# EasyEDA schematic 1-Schematic_CessnaCitationX_AP.json
TITLE: AP BOARD; REV: 1.0; Date: 2018-11-17; Sheet: 1/1; Drawn By: F-ORKI
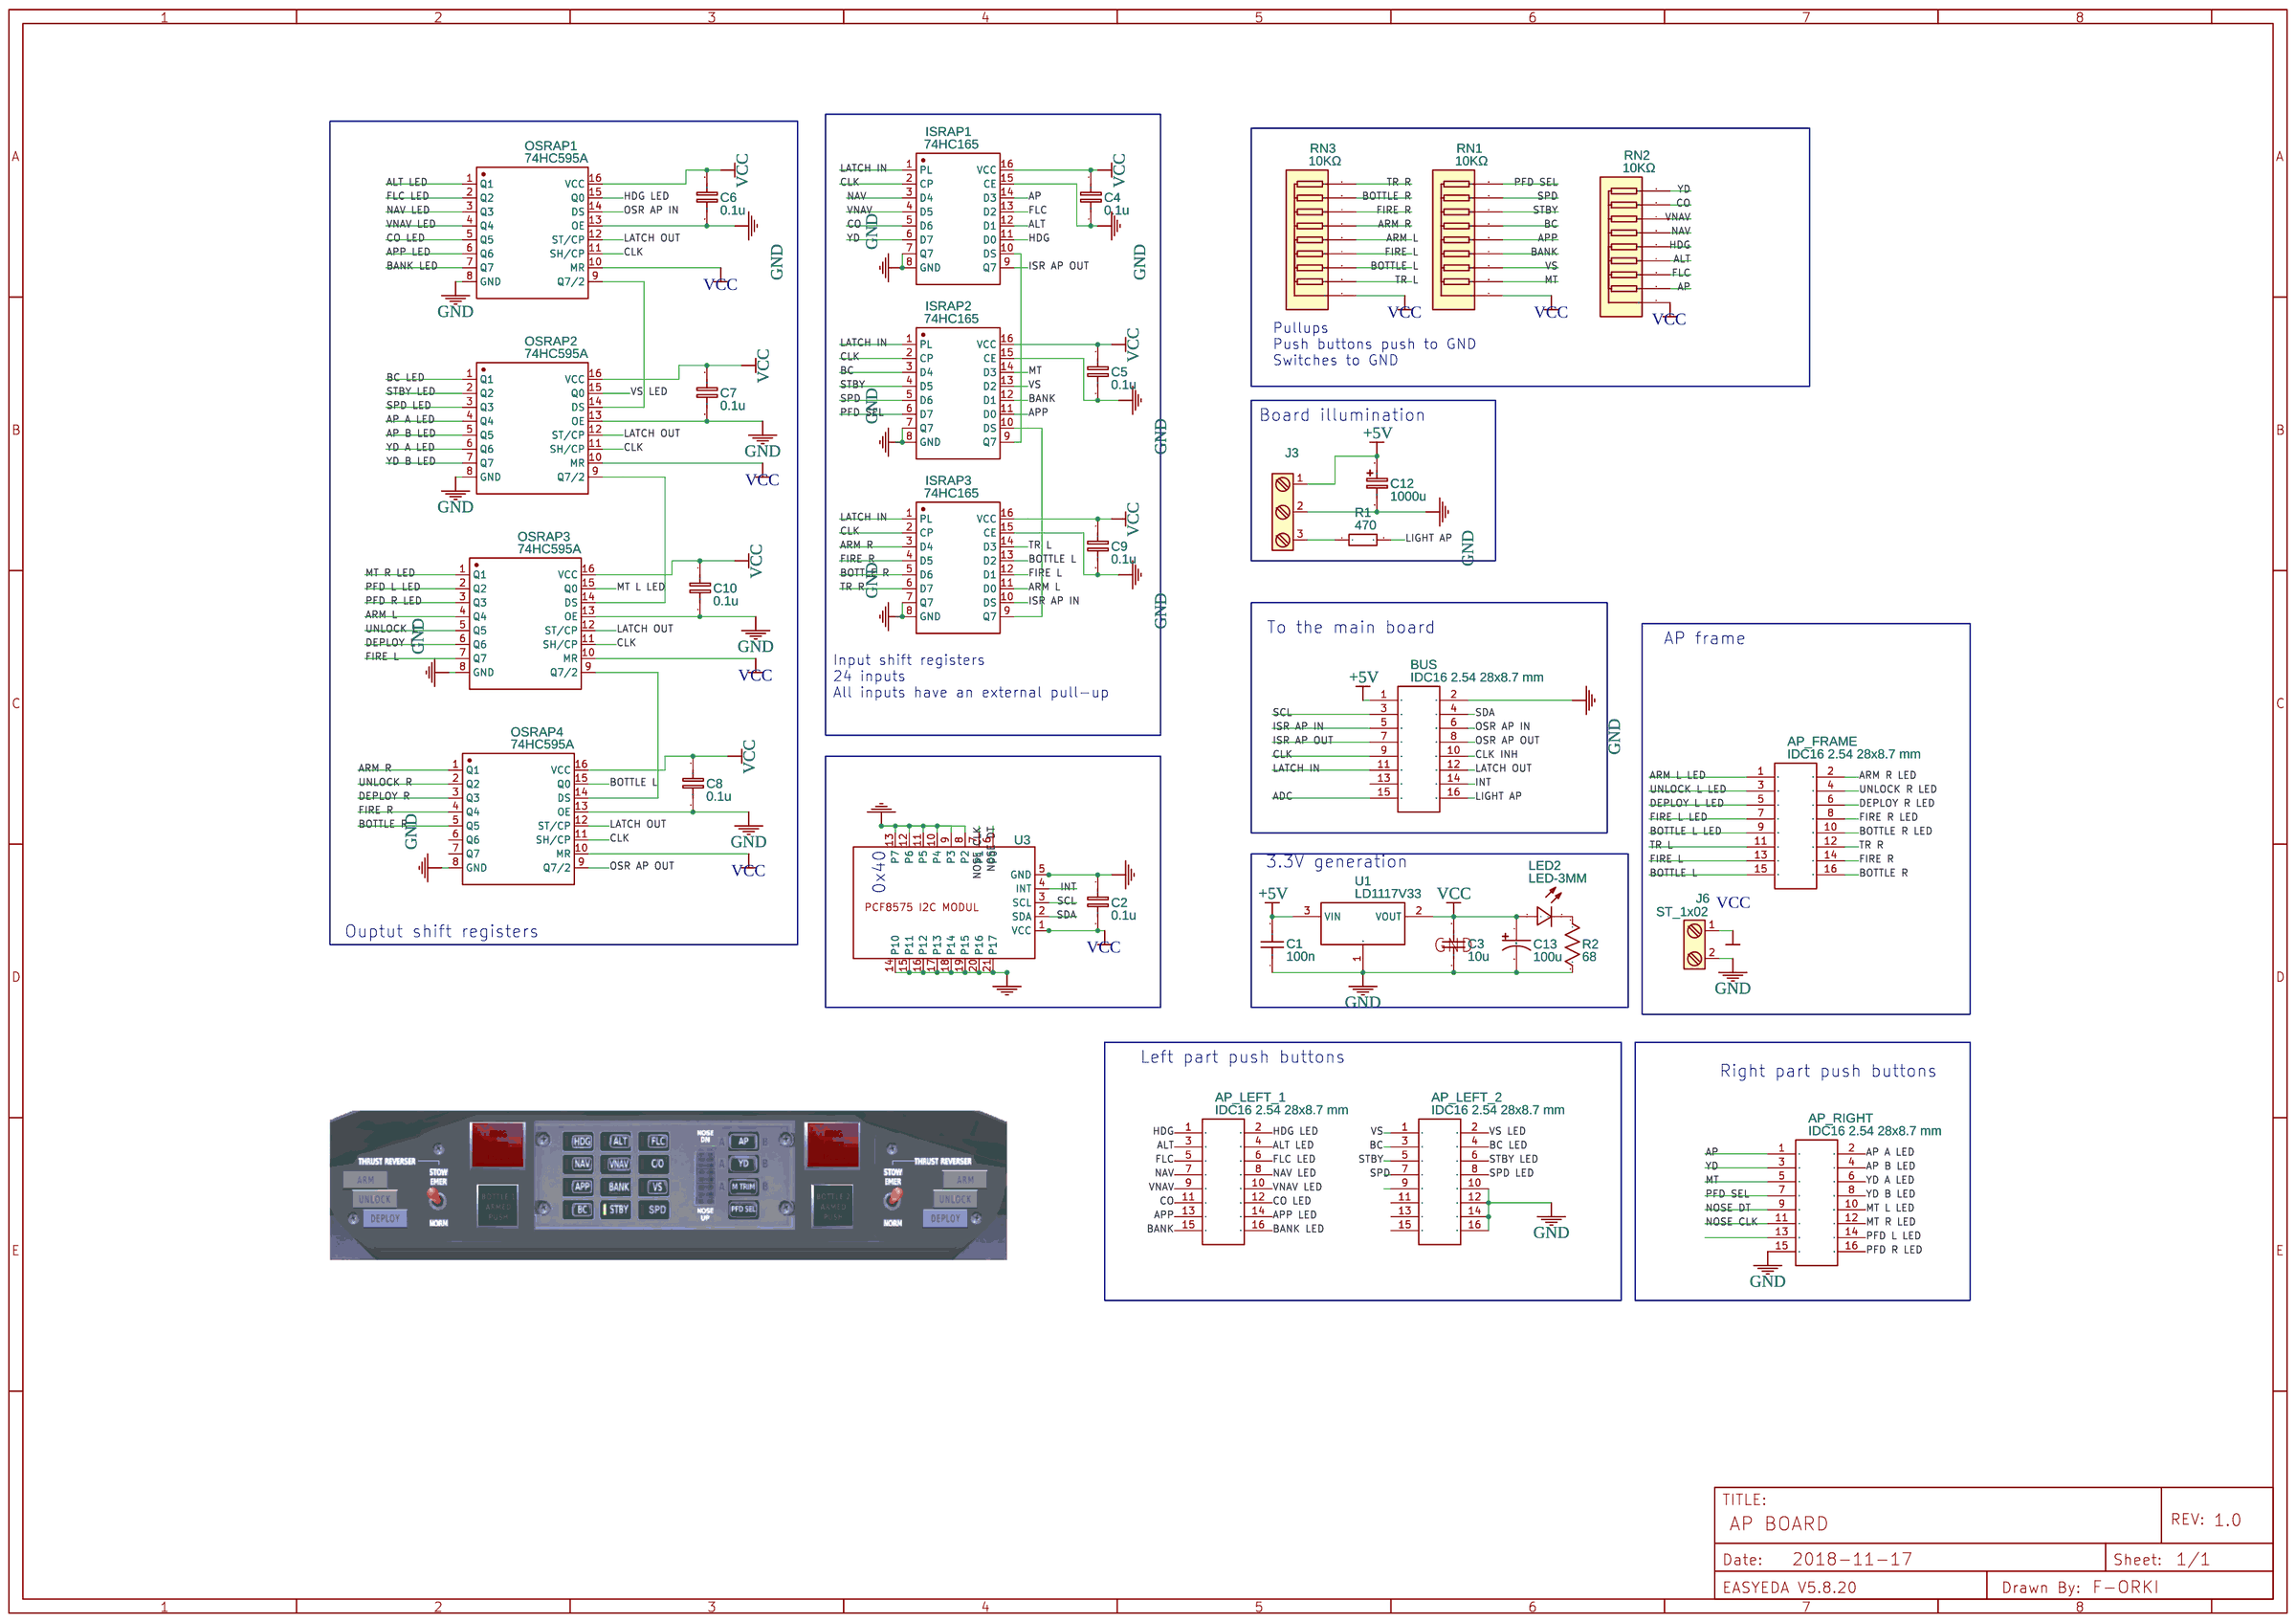
[diagram p0: schematic sheet]

## Parts
AP_FRAME  IDC16 2.54 28x8.7 mm  [IDC16 2.54 28X8.7 MM]
AP_LEFT_1  IDC16 2.54 28x8.7 mm  [IDC16 2.54 28X8.7 MM]
AP_LEFT_2  IDC16 2.54 28x8.7 mm  [IDC16 2.54 28X8.7 MM]
AP_RIGHT  IDC16 2.54 28x8.7 mm  [IDC16 2.54 28X8.7 MM]
BUS  IDC16 2.54 28x8.7 mm  [IDC16 2.54 28X8.7 MM]
C1  100n  [RAD-0.1]
C2  0.1u  [RAD-0.1]
C3  10u  [RAD-0.1]
C4  0.1u  [RAD-0.1]
C5  0.1u  [RAD-0.1]
C6  0.1u  [RAD-0.1]
C7  0.1u  [RAD-0.1]
C8  0.1u  [RAD-0.1]
C9  0.1u  [RAD-0.1]
C10  0.1u  [RAD-0.1]
C12  1000u  [CAP-D3.0XF1.5]
C13  100u  [CAP-D3.0XF1.5]
ISRAP1  74HC165  [DIP16]
ISRAP2  74HC165  [DIP16]
ISRAP3  74HC165  [DIP16]
J3  Screw_Terminal_1x03  [TERMINALBLOCK_PHEONIX_MPT-2.54MM_3POL]
J6  ST_1x02  [TERMINALBLOCK_PHEONIX_MPT-2.54MM_2POL]
LED2  LED-3MM  [LED-3MM/2.54]
OSRAP1  74HC595A  [DIP-16]
OSRAP2  74HC595A  [DIP-16]
OSRAP3  74HC595A  [DIP-16]
OSRAP4  74HC595A  [DIP-16]
R1  470  [AXIAL-0.3]
R2  68  [AXIAL-0.3]
RN1  10KΩ  [SIP-9]
RN2  10KΩ  [SIP-9]
RN3  10KΩ  [SIP-9]
U1  LD1117V33  [TO-220(TO-220-3)]
U3  PCF8575C  [PCF8575C CJMCU-8575]

## Library data of the parts
AP_FRAME AP_LEFT_1 AP_LEFT_2 AP_RIGHT BUS = -: Manufacturer Part: ?; Contributor: julien.pitault.1984
C1 C3 = Cap_RAD-0.1_US: Manufacturer Part: ?
C2 C4-C10 = Cap_RAD-0.1_EU: Manufacturer Part: ?
C12 = Cap_Electrolytic(TH)_D3.0XF1.5_EU: Contributor: EasyEDA; Manufacturer Part: ?
C13 = Cap_Electrolytic(TH)_D3.0XF1.5_US: Manufacturer Part: ?
ISRAP1-ISRAP3 = -: Supplier: LCSC; Manufacturer: Nexperia; Manufacturer Part: 74HC165D,653; LCSC Assembly: Yes; image: //image.lceda.cn/szlcsc/C5613.jpg; Contributor: LCSC; Supplier Part: C5613
J3 J6 = -: Contributor: KiCAD; license: https://www.gnu.org/licenses/lgpl-2.1.html; Manufacturer Part: ?
LED2 = -: Supplier: LCSC; Manufacturer: EVERLIGHT; Manufacturer Part: 204-10SURD/S530-A3; Supplier Part: C99772
OSRAP1-OSRAP4 = -: Supplier: LCSC; Manufacturer: FM; Contributor: LCSC; Supplier Part: C110383
R1 = Res_AXIAL-0.3(1/8W)_EU: Manufacturer Part: ?
R2 = Res_AXIAL-0.3(1/8W)_US: Manufacturer Part: ?
RN1-RN3 = A09-103JP: Supplier: LCSC; Manufacturer: FH; Contributor: LCSC; Supplier Part: C8692
U1 = -: Supplier: LCSC; Supplier Part: C283467; Manufacturer: STMicroelectronics; Contributor: LCSC
U3 = -: Manufacturer Part: ?

## Nets
+5V: BUS.1(P1) C1.2 C12.1 J3.1 U1.3(VIN)
GND: AP_LEFT_2.10(P10) AP_LEFT_2.12 AP_LEFT_2.14 AP_LEFT_2.16 AP_RIGHT.15 BUS.2(P2) C1.1 C2.1 C3.1 C4.2 C5.2 C6.2 C7.2 C8.2 C9.2 C10.2 C12.2 C13.2 ISRAP1.7(Q7) ISRAP1.8(GND) ISRAP1.15(CE) ISRAP2.7(Q7) ISRAP2.8(GND) ISRAP2.15(CE) ISRAP3.7(Q7) ISRAP3.8(GND) ISRAP3.15(CE) J3.2 J6.2 OSRAP1.8(GND) OSRAP1.13(OE) OSRAP2.8(GND) OSRAP2.13(OE) OSRAP3.8(GND) OSRAP3.13(OE) OSRAP4.8(GND) OSRAP4.13(OE) R2.2 U1.1(GND) U3.5(GND) U3.8(P2) U3.9(P3) U3.10(P4) U3.11(P5) U3.12(P6) U3.13(P7) U3.14(P10) U3.15(P11) U3.16(P12) U3.17(P13) U3.18(P14) U3.19(P15) U3.20(P16) U3.21(P17)
VCC: C2.2 C3.2 C4.1 C5.1 C6.1 C7.1 C8.1 C9.1 C10.1 C13.1 ISRAP1.16(VCC) ISRAP2.16(VCC) ISRAP3.16(VCC) J6.1 LED2.1(+) OSRAP1.10(MR) OSRAP1.16(VCC) OSRAP2.10(MR) OSRAP2.16(VCC) OSRAP3.10(MR) OSRAP3.16(VCC) OSRAP4.10(MR) OSRAP4.16(VCC) RN1.1 RN2.1 RN3.1 U1.2(VOUT) U3.1(VCC)
ADC: BUS.15
ALT: AP_LEFT_1.3(P3) ISRAP1.12(D1) RN2.4
ALT LED: AP_LEFT_1.4(P4) OSRAP1.1(Q1)
AP: AP_RIGHT.1(P1) ISRAP1.14(D3) RN2.2
AP A LED: AP_RIGHT.2(P2) OSRAP2.4(Q4)
AP B LED: AP_RIGHT.4(P4) OSRAP2.5(Q5)
APP: AP_LEFT_1.13 ISRAP2.11(D0) RN1.5
APP LED: AP_LEFT_1.14 OSRAP1.6(Q6)
ARM L: ISRAP3.11(D0) OSRAP3.4(Q4)
ARM L LED: AP_FRAME.1(P1)
ARM R: ISRAP3.3(D4) OSRAP4.1(Q1) RN3.6
ARM R LED: AP_FRAME.2(P2)
BANK: AP_LEFT_1.15 ISRAP2.12(D1) RN1.4
BANK LED: AP_LEFT_1.16 OSRAP1.7(Q7)
BC: AP_LEFT_2.3(P3) ISRAP2.3(D4) RN1.6
BC LED: AP_LEFT_2.4(P4) OSRAP2.1(Q1)
BOTTLE L: AP_FRAME.15 ISRAP3.13(D2) OSRAP4.15(Q0)
BOTTLE L LED: AP_FRAME.9(P9)
BOTTLE R: AP_FRAME.16 ISRAP3.5(D6) OSRAP4.5(Q5) RN3.8
BOTTLE R LED: AP_FRAME.10(P10)
CLK: BUS.9(P9) ISRAP1.2(CP) ISRAP2.2(CP) ISRAP3.2(CP) OSRAP1.11(SH/CP) OSRAP2.11(SH/CP) OSRAP3.11(SH/CP) OSRAP4.11(SH/CP)
CLK INH: BUS.10(P10)
CO: AP_LEFT_1.11 ISRAP1.5(D6) RN2.8
CO LED: AP_LEFT_1.12 OSRAP1.5(Q5)
DEPLOY L: OSRAP3.6(Q6)
DEPLOY L LED: AP_FRAME.5(P5)
DEPLOY R: OSRAP4.3(Q3)
DEPLOY R LED: AP_FRAME.6(P6)
FIRE L: AP_FRAME.13 ISRAP3.12(D1) OSRAP3.7(Q7)
FIRE L LED: AP_FRAME.7(P7)
FIRE R: AP_FRAME.14 ISRAP3.4(D5) OSRAP4.4(Q4) RN3.7
FIRE R LED: AP_FRAME.8(P8)
FLC: AP_LEFT_1.5(P5) ISRAP1.13(D2) RN2.3
FLC LED: AP_LEFT_1.6(P6) OSRAP1.2(Q2)
HDG: AP_LEFT_1.1(P1) ISRAP1.11(D0) RN2.5
HDG LED: AP_LEFT_1.2(P2) OSRAP1.15(Q0)
INT: BUS.14 U3.4(INT)
ISR AP IN: BUS.5(P5) ISRAP3.10(DS)
ISR AP OUT: BUS.7(P7) ISRAP1.9(Q7)
LATCH IN: BUS.11 ISRAP1.1(PL) ISRAP2.1(PL) ISRAP3.1(PL)
LATCH OUT: BUS.12 OSRAP1.12(ST/CP) OSRAP2.12(ST/CP) OSRAP3.12(ST/CP) OSRAP4.12(ST/CP)
LIGHT AP: BUS.16 R1.2
MT: AP_RIGHT.5(P5) ISRAP2.14(D3) RN1.2
MT L LED: AP_RIGHT.10(P10) OSRAP3.15(Q0)
MT R LED: AP_RIGHT.12 OSRAP3.1(Q1)
NAV: AP_LEFT_1.7(P7) ISRAP1.3(D4) RN2.6
NAV LED: AP_LEFT_1.8(P8) OSRAP1.3(Q3)
NOSE CLK: AP_RIGHT.11 U3.7(P1)
NOSE DT: AP_RIGHT.9(P9) U3.6(P0)
OSR AP IN: BUS.6(P6) OSRAP1.14(DS)
OSR AP OUT: BUS.8(P8) OSRAP4.9(Q7/2)
PFD L LED: AP_RIGHT.14 OSRAP3.2(Q2)
PFD R LED: AP_RIGHT.16 OSRAP3.3(Q3)
PFD SEL: AP_RIGHT.7(P7) ISRAP2.6(D7) RN1.9
SCL: BUS.3(P3) U3.3(SCL)
SDA: BUS.4(P4) U3.2(SDA)
SPD: AP_LEFT_2.7(P7) ISRAP2.5(D6) RN1.8
SPD LED: AP_LEFT_2.8(P8) OSRAP2.3(Q3)
STBY: AP_LEFT_2.5(P5) ISRAP2.4(D5) RN1.7
STBY LED: AP_LEFT_2.6(P6) OSRAP2.2(Q2)
TR L: AP_FRAME.11 ISRAP3.14(D3)
TR R: AP_FRAME.12 ISRAP3.6(D7) RN3.9
UNLOCK L: OSRAP3.5(Q5)
UNLOCK L LED: AP_FRAME.3(P3)
UNLOCK R: OSRAP4.2(Q2)
UNLOCK R LED: AP_FRAME.4(P4)
VNAV: AP_LEFT_1.9(P9) ISRAP1.4(D5) RN2.7
VNAV LED: AP_LEFT_1.10(P10) OSRAP1.4(Q4)
VS: AP_LEFT_2.1(P1) ISRAP2.13(D2) RN1.3
VS LED: AP_LEFT_2.2(P2) OSRAP2.15(Q0)
YD: AP_RIGHT.3(P3) ISRAP1.6(D7) RN2.9
YD A LED: AP_RIGHT.6(P6) OSRAP2.6(Q6)
YD B LED: AP_RIGHT.8(P8) OSRAP2.7(Q7)
ISRAP1_10: ISRAP1.10(DS) ISRAP2.9(Q7)
ISRAP2_10: ISRAP2.10(DS) ISRAP3.9(Q7)
J3_3: J3.3 R1.1
Net-(LED2-2): LED2.2(-) R2.1
OSRAP1_9: OSRAP1.9(Q7/2) OSRAP2.14(DS)
OSRAP2_9: OSRAP2.9(Q7/2) OSRAP3.14(DS)
OSRAP3_9: OSRAP3.9(Q7/2) OSRAP4.14(DS)

Not connected (* = marked no-connect by the designer): AP_LEFT_2 9(P9) 11 13 15; AP_RIGHT 13; BUS 13; OSRAP4 6(Q6) 7(Q7); RN3 2 3 4 5

## Notes on the sheet
- Pullups
  Push buttons push to GND
  Switches to GND
- Board illumination
- To the main board
- AP frame
- Input shift registers
  24 inputs
  All inputs have an external pull-up
- 3.3V generation
- 0x40
- Ouptut shift registers
- Left part push buttons
- Right part push buttons
